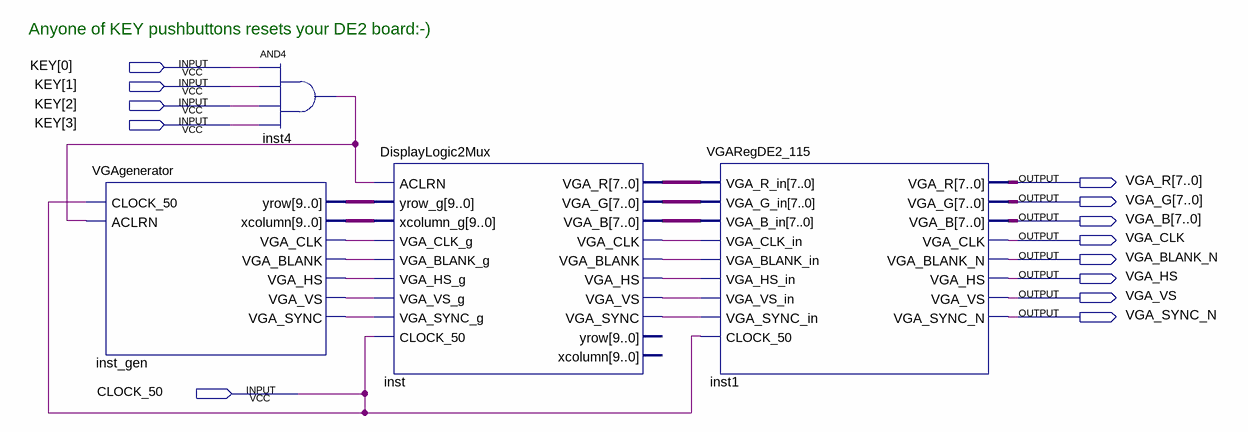
[diagram p0: schematic sheet]
// Quartus schematic DemoMux.bdf as structural Verilog: 4 symbols, 13 pins
module DemoMux (
  input  [3:0] KEY,
  input  CLOCK_50,
  output [7:0] VGA_R,
  output [7:0] VGA_G,
  output [7:0] VGA_B,
  output VGA_CLK,
  output VGA_BLANK_N,
  output VGA_HS,
  output VGA_VS,
  output VGA_SYNC_N
);

  wire inst4_out, inst_gen_vga_blank, inst_gen_vga_clk, inst_gen_vga_hs, inst_gen_vga_sync, inst_gen_vga_vs,
       inst_vga_blank, inst_vga_clk, inst_vga_hs, inst_vga_sync, inst_vga_vs;
  wire [7:0] inst_vga_b, inst_vga_g, inst_vga_r;
  wire [9:0] inst_gen_xcolumn, inst_gen_yrow;

  VGAgenerator inst_gen (
    .CLOCK_50(CLOCK_50), .ACLRN(inst4_out), .yrow(inst_gen_yrow), .xcolumn(inst_gen_xcolumn),
    .VGA_CLK(inst_gen_vga_clk), .VGA_BLANK(inst_gen_vga_blank), .VGA_HS(inst_gen_vga_hs),
    .VGA_VS(inst_gen_vga_vs), .VGA_SYNC(inst_gen_vga_sync));
  and inst4 (inst4_out, KEY[0], KEY[1], KEY[2], KEY[3]);
  DisplayLogic2Mux inst (
    .ACLRN(inst4_out), .yrow_g(inst_gen_yrow), .xcolumn_g(inst_gen_xcolumn), .VGA_CLK_g(inst_gen_vga_clk),
    .VGA_BLANK_g(inst_gen_vga_blank), .VGA_HS_g(inst_gen_vga_hs), .VGA_VS_g(inst_gen_vga_vs),
    .VGA_SYNC_g(inst_gen_vga_sync), .CLOCK_50(CLOCK_50), .VGA_R(inst_vga_r), .VGA_G(inst_vga_g),
    .VGA_B(inst_vga_b), .VGA_CLK(inst_vga_clk), .VGA_BLANK(inst_vga_blank), .VGA_HS(inst_vga_hs),
    .VGA_VS(inst_vga_vs), .VGA_SYNC(inst_vga_sync));  // open: yrow, xcolumn
  VGARegDE2_115 inst1 (
    .VGA_R_in(inst_vga_r), .VGA_G_in(inst_vga_g), .VGA_B_in(inst_vga_b), .VGA_CLK_in(inst_vga_clk),
    .VGA_BLANK_in(inst_vga_blank), .VGA_HS_in(inst_vga_hs), .VGA_VS_in(inst_vga_vs),
    .VGA_SYNC_in(inst_vga_sync), .CLOCK_50(CLOCK_50), .VGA_R(VGA_R), .VGA_G(VGA_G), .VGA_B(VGA_B),
    .VGA_CLK(VGA_CLK), .VGA_BLANK_N(VGA_BLANK_N), .VGA_HS(VGA_HS), .VGA_VS(VGA_VS), .VGA_SYNC_N(VGA_SYNC_N));

  // Notes on the sheet:
  //   Anyone of KEY pushbuttons resets your DE2 board:-)
endmodule
